# EAGLE schematic Meadowlark_Mini_Schematic_v30 (EAGLE 9.7.0)
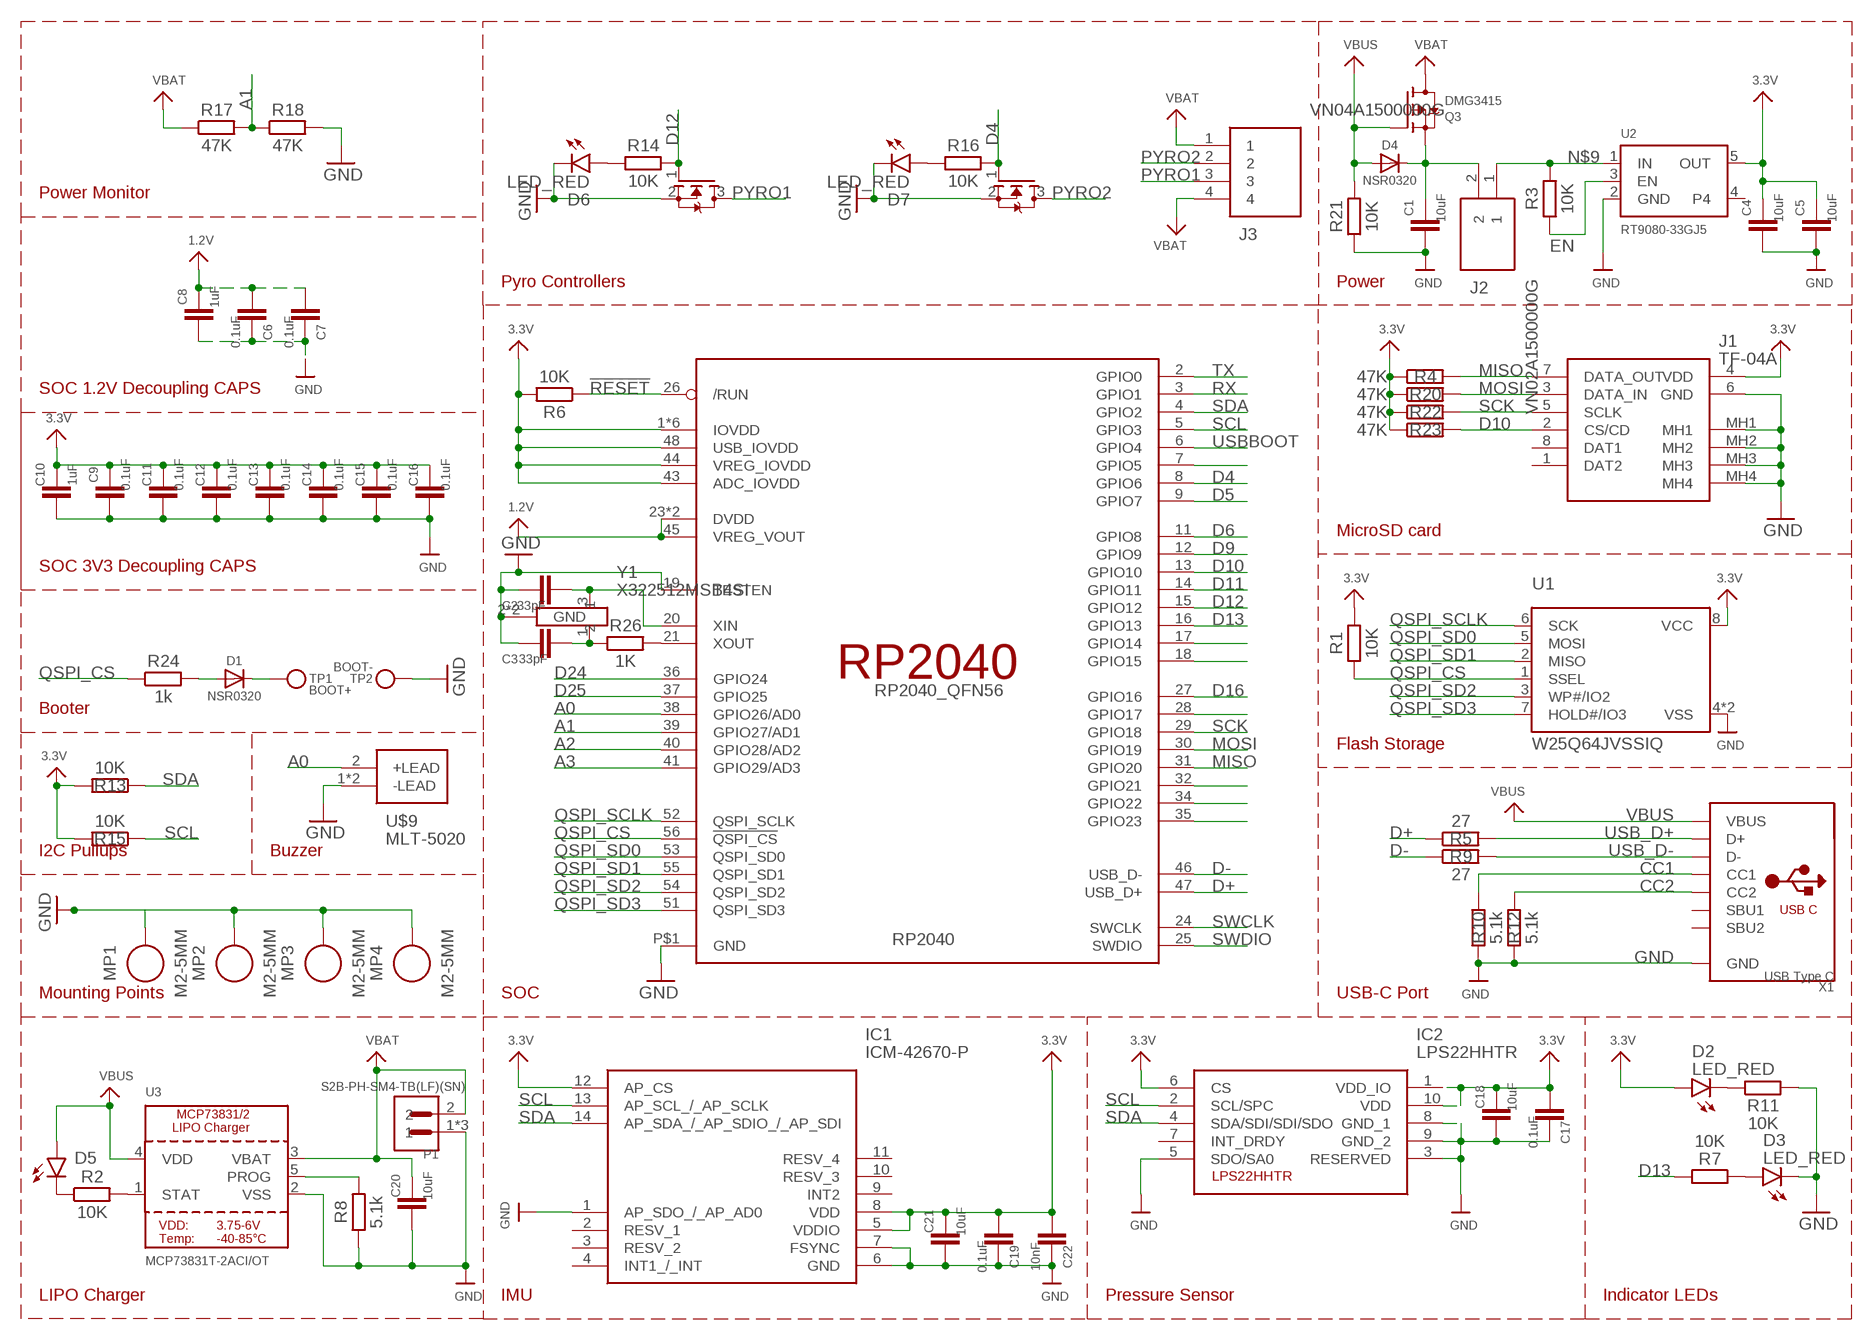
[diagram p0: schematic, sheet 1]

## Parts
C1  10uF  C_CHIP-0402(1005-METRIC)  [CAPC1005X60]
C2  33pF  C_CHIP-0402(1005-METRIC)  [CAPC1005X60]
C3  33pF  C_CHIP-0402(1005-METRIC)  [CAPC1005X60]
C4  10uF  C_CHIP-0402(1005-METRIC)  [CAPC1005X60]
C5  10uF  C_CHIP-0402(1005-METRIC)  [CAPC1005X60]
C6  0.1uF  C_CHIP-0402(1005-METRIC)  [CAPC1005X60]
C7  0.1uF  C_CHIP-0402(1005-METRIC)  [CAPC1005X60]
C8  1uF  C_CHIP-0402(1005-METRIC)  [CAPC1005X60]
C9  0.1uF  C_CHIP-0402(1005-METRIC)  [CAPC1005X60]
C10  1uF  C_CHIP-0402(1005-METRIC)  [CAPC1005X60]
C11  0.1uF  C_CHIP-0402(1005-METRIC)  [CAPC1005X60]
C12  0.1uF  C_CHIP-0402(1005-METRIC)  [CAPC1005X60]
C13  0.1uF  C_CHIP-0402(1005-METRIC)  [CAPC1005X60]
C14  0.1uF  C_CHIP-0402(1005-METRIC)  [CAPC1005X60]
C15  0.1uF  C_CHIP-0402(1005-METRIC)  [CAPC1005X60]
C16  0.1uF  C_CHIP-0402(1005-METRIC)  [CAPC1005X60]
C17  0.1uF  C_CHIP-0402(1005-METRIC)  [CAPC1005X60]
C18  10uF  C_CHIP-0402(1005-METRIC)  [CAPC1005X60]
C19  0.1uF  C_CHIP-0402(1005-METRIC)  [CAPC1005X60]
C20  10uF  C_CHIP-0402(1005-METRIC)  [CAPC1005X60]
C21  10uF  C_CHIP-0402(1005-METRIC)  [CAPC1005X60]
C22  10nF  C_CHIP-0402(1005-METRIC)  [CAPC1005X60]
D1  NSR0320  DIODE_SOD323MINI  [SOD-323_MINI]
D2  LED_RED  CHIP-FLAT-R_0603-0.55MM  [LEDC1608X55N_FLAT-R]
D3  LED_RED  CHIP-FLAT-R_0603-0.55MM  [LEDC1608X55N_FLAT-R]
D4  NSR0320  DIODE_SOD323MINI  [SOD-323_MINI]
D5  LED_YELLOW  CHIP-FLAT-Y_0603-0.55MM  [LEDC1608X55N_FLAT-Y]
D6  LED_RED  CHIP-FLAT-R_0603-0.55MM  [LEDC1608X55N_FLAT-R]
D7  LED_RED  CHIP-FLAT-R_0603-0.55MM  [LEDC1608X55N_FLAT-R]
IC1  ICM-42670-P  [ICM42670P]
IC2  LPS22HHTR  [LPS22HHTR]
J1  TF-04A  [TF04A]
J2  VN02A1500000G  [VN02A1500000G]
J3  VN04A1500000G  [VN04A1500000G]
MP1  M2-5MM  STANDOFF_M/F_M2_5MM  [STANDOFF_HEX_MALE-FEMALE_400X500_M2X0.4_MTGP600H220]
MP2  M2-5MM  STANDOFF_M/F_M2_5MM  [STANDOFF_HEX_MALE-FEMALE_400X500_M2X0.4_MTGP600H220]
MP3  M2-5MM  STANDOFF_M/F_M2_5MM  [STANDOFF_HEX_MALE-FEMALE_400X500_M2X0.4_MTGP600H220]
MP4  M2-5MM  STANDOFF_M/F_M2_5MM  [STANDOFF_HEX_MALE-FEMALE_400X500_M2X0.4_MTGP600H220]
P1  S2B-PH-SM4-TB(LF)(SN)  [JST_S2B-PH-SM4-TB(LF)(SN)]
Q1  AO3400A  MOSFET-NWIDE  [SOT23-WIDE]
Q2  AO3400A  MOSFET-NWIDE  [SOT23-WIDE]
Q3  DMG3415  MOSFET-P  [SOT23-R]
R1  10K  RESISTOR__CHIP-0402(1005-METRIC)  [RESC1005X40]
R2  10K  RESISTOR__CHIP-0402(1005-METRIC)  [RESC1005X40]
R3  10K  RESISTOR__CHIP-0402(1005-METRIC)  [RESC1005X40]
R4  47K  RESISTOR__CHIP-0402(1005-METRIC)  [RESC1005X40]
R5  27  RESISTOR__CHIP-0402(1005-METRIC)  [RESC1005X40]
R6  10K  RESISTOR__CHIP-0402(1005-METRIC)  [RESC1005X40]
R7  10K  RESISTOR__CHIP-0402(1005-METRIC)  [RESC1005X40]
R8  5.1k  RESISTOR__CHIP-0402(1005-METRIC)  [RESC1005X40]
R9  27  RESISTOR__CHIP-0402(1005-METRIC)  [RESC1005X40]
R10  5.1k  RESISTOR__CHIP-0402(1005-METRIC)  [RESC1005X40]
R11  10K  RESISTOR__CHIP-0402(1005-METRIC)  [RESC1005X40]
R12  5.1k  RESISTOR__CHIP-0402(1005-METRIC)  [RESC1005X40]
R13  10K  RESISTOR__CHIP-0402(1005-METRIC)  [RESC1005X40]
R14  10K  RESISTOR__CHIP-0402(1005-METRIC)  [RESC1005X40]
R15  10K  RESISTOR__CHIP-0402(1005-METRIC)  [RESC1005X40]
R16  10K  RESISTOR__CHIP-0402(1005-METRIC)  [RESC1005X40]
R17  47K  RESISTOR__CHIP-0402(1005-METRIC)  [RESC1005X40]
R18  47K  RESISTOR__CHIP-0402(1005-METRIC)  [RESC1005X40]
R20  47K  RESISTOR__CHIP-0402(1005-METRIC)  [RESC1005X40]
R21  10K  RESISTOR__CHIP-0402(1005-METRIC)  [RESC1005X40]
R22  47K  RESISTOR__CHIP-0402(1005-METRIC)  [RESC1005X40]
R23  47K  RESISTOR__CHIP-0402(1005-METRIC)  [RESC1005X40]
R24  1k  R_CHIP-0402(1005-METRIC)  [RESC1005X40]
R26  1K  RESISTOR__CHIP-0402(1005-METRIC)  [RESC1005X40]
RP2040  RP2040_QFN56  [QFN56_7MM_REDUCEDEPAD]
TP1  BOOT+  TESTPOINTROUND1.5MMNO  [TESTPOINT_ROUND_1.5MM_NO]
TP2  BOOT-  TESTPOINTROUND1.5MMNO  [TESTPOINT_ROUND_1.5MM_NO]
U1  W25Q64JVSSIQ  SPIFLASH_8PIN_4X4  [USON8_4X4]
U2  RT9080-33GJ5  VREG_SOT23-5  [SOT23-5]
U3  MCP73831T-2ACI/OT  MCP73831/2  [SOT23-5]
U$9  MLT-5020  [MLT5020]
X1  USB Type C  USB_C  [USB_C_CUSB31-CFM2AX-01-X]
Y1  X322512MSB4SI  [X322512MSB4SI]

## Nets
1.2V: C6.2 C7.2 C8.1 RP2040.23(DVDD) RP2040.45(VREG_VOUT) RP2040.50(DVDD)
3.3V: C4.1 C5.1 C9.1 C10.1 C11.1 C12.1 C13.1 C14.1 C15.1 C16.1 C17.2 C18.1 C19.2 C21.1 C22.2 D2.A IC1.5(VDDIO) IC1.8(VDD) IC1.12(AP_CS) IC2.1(VDD_IO) IC2.6(CS) IC2.10(VDD) J1.4(VDD) R1.2 R4.1 R6.2 R13.2 R15.2 R20.1 R22.1 R23.1 RP2040.1(IOVDD) RP2040.10(IOVDD) RP2040.22(IOVDD) RP2040.33(IOVDD) RP2040.42(IOVDD) RP2040.43(ADC_IOVDD) RP2040.44(VREG_IOVDD) RP2040.48(USB_IOVDD) RP2040.49(IOVDD) U1.8(VCC) U2.5(OUT)
!RESET: R6.1 RP2040.26(/RUN)
A0: RP2040.38(GPIO26/AD0) U$9.2(+LEAD)
A1: R17.2 R18.1 RP2040.39(GPIO27/AD1)
A2: RP2040.40(GPIO28/AD2)
A3: RP2040.41(GPIO29/AD3)
CC1: R10.2 X1.A5(CC1)
CC2: R12.2 X1.B5(CC2)
D4: Q2.1(G) R16.2 RP2040.8(GPIO6)
D5: RP2040.9(GPIO7)
D6: RP2040.11(GPIO8)
D9: RP2040.12(GPIO9)
D10: J1.2(CS/CD) R23.2 RP2040.13(GPIO10)
D11: RP2040.14(GPIO11)
D12: Q1.1(G) R14.2 RP2040.15(GPIO12)
D13: R7.2 RP2040.16(GPIO13)
D16: RP2040.27(GPIO16)
D24: RP2040.36(GPIO24)
D25: RP2040.37(GPIO25)
D+: R5.1 RP2040.47(USB_D+)
D-: R9.1 RP2040.46(USB_D-)
EN: R3.1 U2.3(EN)
GND [power]: C1.2 C2.1 C3.1 C4.2 C5.2 C6.1 C7.1 C8.2 C9.2 C10.2 C11.2 C12.2 C13.2 C14.2 C15.2 C16.2 C17.1 C18.2 C19.1 C20.2 C21.2 C22.1 D3.C D6.C D7.C IC1.1(AP_SDO_/_AP_AD0) IC1.6(GND) IC1.7(FSYNC) IC2.3(RESERVED) IC2.5(SDO/SA0) IC2.8(GND_1) IC2.9(GND_2) J1.6(GND) J1.MH1 J1.MH2 J1.MH3 J1.MH4 MP1.1 MP2.1 MP3.1 MP4.1 P1.1 P1.P1 P1.P2 Q1.2(S) Q2.2(S) R8.1 R10.1 R11.2 R12.1 R18.2 R21.1 RP2040.19(TESTEN) RP2040.P$1(GND) TP2.P$1 U1.4(VSS) U1.PAD(VSS) U2.2(GND) U3.2(VSS) U$9.1(-LEAD) U$9.3(-LEAD) X1.A1B12(GND) X1.B1A12(GND) Y1.2(GND) Y1.4(GND)
MISO: J1.7(DATA_OUT) R4.2 RP2040.31(GPIO20)
MOSI: J1.3(DATA_IN) R20.2 RP2040.30(GPIO19)
N$1: D5.C R2.1
N$2: D2.C R11.1
N$3: R2.2 U3.1(STAT)
N$4: R8.2 U3.5(PROG)
N$5: D6.A R14.1
N$6: C3.2 R26.1 Y1.1
N$7: R26.2 RP2040.21(XOUT)
N$8: D1.A R24.2
N$9 [power]: J2.1 R3.2 U2.1(IN)
N$10: D3.A R7.1
N$11: D7.A R16.1
N$12: RP2040.17(GPIO14)
N$13: C2.2 RP2040.20(XIN) Y1.3
N$14: RP2040.18(GPIO15)
N$15: RP2040.7(GPIO5)
N$18: RP2040.28(GPIO17)
N$19: RP2040.32(GPIO21)
N$20: RP2040.34(GPIO22)
N$21: RP2040.35(GPIO23)
PYRO1: J3.3 Q1.3(D)
PYRO2: J3.2 Q2.3(D)
QSPI_CS: R1.1 R24.1 RP2040.56(!QSPI_CS) U1.1(SSEL)
QSPI_SCLK: RP2040.52(QSPI_SCLK) U1.6(SCK)
QSPI_SD0: RP2040.53(QSPI_SD0) U1.5(MOSI)
QSPI_SD1: RP2040.55(QSPI_SD1) U1.2(MISO)
QSPI_SD2: RP2040.54(QSPI_SD2) U1.3(WP#/IO2)
QSPI_SD3: RP2040.51(QSPI_SD3) U1.7(HOLD#/IO3)
RX: RP2040.3(GPIO1)
SCK: J1.5(SCLK) R22.2 RP2040.29(GPIO18)
SCL: IC1.13(AP_SCL_/_AP_SCLK) IC2.2(SCL/SPC) R15.1 RP2040.5(GPIO3)
SDA: IC1.14(AP_SDA_/_AP_SDIO_/_AP_SDI) IC2.4(SDA/SDI/SDI/SDO) R13.1 RP2040.4(GPIO2)
SWCLK: RP2040.24(SWCLK)
SWDIO: RP2040.25(SWDIO)
TX: RP2040.2(GPIO0)
USB_D+: R5.2 X1.A6(D+) X1.B6(D+)
USB_D-: R9.2 X1.A7(D-) X1.B7(D-)
USBBOOT: D1.C RP2040.6(GPIO4) TP1.P$1
VBAT [power]: C20.1 J3.1 J3.4 P1.2 Q3.3(D) R17.1 U3.3(VBAT)
VBUS [power]: D4.A D5.A Q3.1(G) R21.2 U3.4(VDD) X1.A4B9(VBUS) X1.B4A9(VBUS)
VHI [power]: C1.1 D4.C J2.2 Q3.2(S)
Unconnected: IC1.2(RESV_1) IC1.3(RESV_2) IC1.4(INT1_/_INT) IC1.9(INT2) IC1.10(RESV_3) IC1.11(RESV_4) IC2.7(INT_DRDY) J1.1(DAT2) J1.8(DAT1) U2.4 X1.A8(SBU1) X1.B8(SBU2)

## Notes on the sheet
- Power Monitor
- Pyro Controllers | Power
- SOC 1.2V Decoupling CAPS
- MicroSD card
- SOC 3V3 Decoupling CAPS
- Booter
- Flash Storage
- I2C Pullups | Buzzer
- Mounting Points | SOC | USB-C Port
- LIPO Charger | IMU | Pressure Sensor | Indicator LEDs

## Library data of the parts
C1-C22 = Capacitor:C: Capacitor - Generic; CATEGORY: Capacitor
D1 D4 = microbuilder:DIODE: Diode SMA Model Volts Amps Type Vf Ir Digikey # Notes SSA34-E3 40V 3A Schottky 480mV @ 3A 200uA @ 40V SSA34-E3/61TGITR-ND CDBA120-G 20V 1A Schottky 500mV @ 1A 500uA @ 20V 641-1014-6-ND REEL MBRA210 10V 2A Schottky 350mV @ 2A 700uA @ 10V MBRA210LT3 SOD-123 Model Volts Amps Type Vf Ir Order # Notes BAT54T1G 30V 200mA Schottky 800mV @ 200mA 2uA @ 25V BAT54T1GOSTR-ND B0530W 30V 500mA Schottky 430mV @ 500mA 130uA @ 30V B0530W-FDICT-ND REEL MBR120 20V 1A Schottky 340mV @ 1A MBR120VLSFT1GOSCT-ND SOD-323 Model Volts Amps Type Vf Ir Order # Notes PMEG2005EJ 20V 500mA Schottky 355mV @ 500mA 568-4110-1-ND ZLLS410 10V 570mA Schottky 380mV @ 570mA ZLLS410CT-ND 1N4148WS 75V 150mA Silicon/Simple 1V 1N4148WSFSCT-ND REEL SOD-523 Model Volts Amps Type Vf Ir Order # Notes BAT54XV2 30V 200mA Schottky 0.8V @ 100mA BAT54XV2CT-ND TB751S 30V 30mA Schottky RB751S-40TE61CT-ND SOT23-R/W (R = Solder Paste/Reflow Ovens, W = Hand-Soldering) Model Volts Amps Type Vf Ir Order # Notes BAT54FILM 40V 300mA Schottky 497-7162-1-ND POWERDI-5 Model Volts Amps Type Vf Ir Order # Notes PDS560 60V 5A Schottky 670mV @ 5A 150uA @ 60V PDS560DICT-ND
D2 D3 D6 D7 = LED:CHIP-FLAT-R; CATEGORY: LED; COLOR: RED; DESCRIPTION: CHIP LED FLAT; SUB-CATEGORY: CHIP; TYPE: FLAT_TOP
D5 = LED:CHIP-FLAT-Y; CATEGORY: LED; COLOR: YELLOW; DESCRIPTION: CHIP LED FLAT; SUB-CATEGORY: CHIP; TYPE: FLAT_TOP
IC1 = ICM-42670-P:ICM-42670-P: IMUs - Inertial Measurement Units Low-Power, Premium Performance 6-Axis MotionTrackingTM IMU with I3C, I2C and SPI interface in 2.5mm x 3mm Package Source: Datasheet <https://3cfeqx1hf82y3xcoull08ihx-wpengine.netdna-ssl.com/wp-content/uploads/2021/07/DS-000451-ICM-42670-P-v1.0.pdf>; DESCRIPTION: IMUs - Inertial Measurement Units Low-Power, Premium Performance 6-Axis MotionTrackingTM IMU with I3C, I2C and SPI interface in 2.5mm x 3mm Package; HEIGHT: mm; MANUFACTURER_NAME: TDK; MANUFACTURER_PART_NUMBER: ICM-42670-P; MOUSER_PART_NUMBER: 410-ICM-42670-P; MOUSER_PRICE-STOCK: https://www.mouser.co.uk/ProductDetail/TDK-InvenSense/ICM-42670-P?qs=iLbezkQI%252BsgK8sMF5V7fQQ%3D%3D
IC2 = LPS22HHTR:LPS22HHTR: STMICROELECTRONICS - LPS22HHTR - PRESSURE SENSOR, HLGA-10 Source: Datasheet <https://www.st.com/resource/en/datasheet/lps22hh.pdf>; ARROW_PART_NUMBER: LPS22HHTR; ARROW_PRICE-STOCK: https://www.arrow.com/en/products/lps22hhtr/stmicroelectronics?region=nac; DESCRIPTION: STMICROELECTRONICS - LPS22HHTR - PRESSURE SENSOR, HLGA-10; HEIGHT: mm; MANUFACTURER_NAME: STMicroelectronics; MANUFACTURER_PART_NUMBER: LPS22HHTR; MOUSER_PART_NUMBER: 511-LPS22HHTR; MOUSER_PRICE-STOCK: https://www.mouser.co.uk/ProductDetail/STMicroelectronics/LPS22HHTR?qs=lc2O%252BfHJPVbKAkJQGWFcLg%3D%3D
J1 = TF-04A:TF-04A: 13.55*13.51mm Card Sockets Connectors Source: Datasheet <https://datasheet.lcsc.com/szlcsc/1903221102_Korean-Hroparts-Elec-TF-04A_C145799.pdf>; DESCRIPTION: 13.55*13.51mm Card Sockets Connectors; HEIGHT: 1.5mm; MANUFACTURER_NAME: Korean Hroparts Elec; MANUFACTURER_PART_NUMBER: TF-04A
J2 = VN02A1500000G:VN02A1500000G: 2 Position Wire to Board Terminal Block Horizontal with Board 0.100" (2.54mm) Through Hole Source: Datasheet <http://www.anytek.com.tw/UserUpFiles/20120512/L_wOt9EJEyJN.pdf>; DESCRIPTION: 2 Position Wire to Board Terminal Block Horizontal with Board 0.100" (2.54mm) Through Hole; HEIGHT: 8.8mm; MANUFACTURER_NAME: Amphenol; MANUFACTURER_PART_NUMBER: VN02A1500000G; MOUSER_PART_NUMBER: 649-VN02A15000J0G; MOUSER_PRICE-STOCK: https://www.mouser.co.uk/ProductDetail/Amphenol-Anytek/VN02A1500000G?qs=Mv7BduZupUgf8d3Xo6xdxw%3D%3D
J3 = VN04A1500000G:VN04A1500000G: 4 Position Wire to Board Terminal Block Horizontal with Board 0.100" (2.54mm) Through Hole Source: Datasheet <http://www.anytek.com.tw/UserUpFiles/20120512/L_wOt9EJEyJN.pdf>; DESCRIPTION: 4 Position Wire to Board Terminal Block Horizontal with Board 0.100" (2.54mm) Through Hole; HEIGHT: 8.8mm; MANUFACTURER_NAME: Amphenol; MANUFACTURER_PART_NUMBER: VN04A1500000G; MOUSER_PART_NUMBER: 649-VN04A15000J0G; MOUSER_PRICE-STOCK: https://www.mouser.co.uk/ProductDetail/Amphenol-Anytek/VN04A1500000G?qs=Mv7BduZupUg1gSttWAc7xA%3D%3D
MP1-MP4 = PCB-Fasteners_Hardware:STANDOFF_M/F: Male-Male Standoff/Spacer with Mounting pad and hole. Essentra : Male-Female Standoff <https://www.essentracomponents.co.in/index.php?option=com_virtuemart&view=productdetails&virtuemart_product_id=14556> The hole and pad sizes may vary based on the application and type of hardware; always verify the Manufacturer specification or Global Standards.; CATEGORY: Standoff/Spacer; SUB-CATEGORY: Male-Female
P1 = S2B-PH-SM4-TB_LF__SN_:S2B-PH-SM4-TB(LF)(SN): CONN HEADER PH SIDE 2POS 2MM SMD Check availability <https://pricing.snapeda.com/parts/S2B-PH-SM4-TB%20%28LF%29%28SN%29/JST%20Sales/view-part?ref=eda>; AVAILABILITY: In Stock; CHECK_PRICES: https://www.snapeda.com/parts/S2B-PH-SM4-TB%20(LF)(SN)/JST+Sales+America+Inc./view-part/?ref=eda; DESCRIPTION: Connector Header Surface Mount, Right Angle 2 position 0.079 (2.00mm); MF: JST Sales; MP: S2B-PH-SM4-TB (LF)(SN); PACKAGE: None; PRICE: None; SNAPEDA_LINK: https://www.snapeda.com/parts/S2B-PH-SM4-TB%20(LF)(SN)/JST+Sales+America+Inc./view-part/?ref=snap
Q1 Q2 = microbuilder:MOSFET-N: N-Channel Mosfet LEGEND VDS: Voltage Drain-Source ID: Drain Current RDS(ON): Drain-Source On-State Resistance VGS(TH): Gate-Source Threshold Voltage CISS: Drain-Source Input Capacitance SOT-23 Name VDS ID RDS(ON) VGS(TH) CISS Order Number 2N7002E 60V 260mA 2.5 Ohm 2.5V @ 250uA 26.7pF @ 25V 2N7002ET1GOSTR-ND BSH103 30V 850mA 400 mOhm 400mV @ 1mA 83pF @ 24V BSH103,235-ND BSS138 60V 320mA 1.6 Ohm 1.5V @ 250uA 50pF @ 10V Mouser: 771-BSS138PW115 DMN2075U-7 20V 4.2A 38 mOhm 1V @ 250 uA 594.3pF @ 10V DMN2075U-7DICT-ND * BSS138 good choice for I2C level-shifting POWERPAK 1212-8 Name VDS ID RDS(ON) VGS(TH) CISS Order Number Si7308DN 60V 6A 58 mOhm 3V @ 250uA 665pF @ 15V SI7308DN-T1-E3CT-ND
Q3 = microbuilder:MOSFET-P: P-Channel Mosfet LEGEND VDS: Voltage Drain-Source ID: Drain Current RDS(ON): Drain-Source On-State Resistance VGS(TH): Gate-Source Threshold Voltage CISS: Drain-Source Input Capacitance SOT-23 Name VDS ID RDS(ON) VGS(TH) CISS Order Number IRLML5103 30V 760mA 600 mOhm -- 75pF @ 25V Digikey: IRLML5103PBFCT-ND IRLML6401 12V 4.3A 50 mOhm 950mV @ 250µA 830pF @ 10V Digikey: IRLML6401PBFTR-ND NTR0202PL 20V 400mA 800 mOhm 2.3V @ 250uA 70pF @ 5V Digikey: NTR0202PLT1GOSTR-ND NTR4101PT1G 20V 1.8A 85 mOhm 1.2V @ 250uA 675pF @ 10V Digikey: NTR4101PT1GOSCT-ND DMP2004K 20V 600mA 900 mOhm 1V @ 250uA 175pF @ 16V Digikey: DMP2004KDICT-ND PMV65XP 20V 3.9A 76 mOhm 950mV @ 1mA 725pF @ 20V Digikey: 568-2358-2-ND TO-252 Name VDS ID RDS(ON) VGS(TH) CISS Order Number AOD417 30V 25A 34 mOhm 3V @ 250µA 920pF @ 15V Digikey: 785-1106-2-ND PowerPak Name VDS ID RDS(ON) VGS(TH) CISS Order Number AON7401 30V 12A 14 mOhm 3V @ 250µA 2600pF @ 15V Digikey: 785-1302-1-ND
R1-R18 R20-R23 R26 = Tinkercad:RESISTOR: Resistor Fixed - Generic; CATEGORY: Resistor; SUB-CATEGORY: Fixed
R24 = Resistor:R: Resistor Fixed - Generic; CATEGORY: Resistor; SUB-CATEGORY: Fixed
RP2040 = adafruit_micro:RP2040; LCSC: C2040
TP1 TP2 = microbuilder:TESTPOINT: Test Point Various test points for characterisation and PCB testing TESTPOINT_SMT - Compact Surface Mount Test Point [Digikey: 5016KTR-ND]
U1 = microbuilder:SPIFLASH_8PIN: SOIC8 SPI Flash Be careful with the size since SOIC8 flash comes in several 'widths' SOIC8 150 mil M25P16 - 16Mbit (2Mbit x 8) Serial Flash (75MHz SPI Bus), Supply: 2.7-3.6V Digikey: SOIC8 - M25P16-VMN6P-ND SOIC8 208 mil W25Q16BVSSIG - 16Mbit (2Mbit x 8) Serial Flash (104MHz SPI Bus), Supply: 2.7-3.6V Digikey: SOIC8 - W25Q16BVSSIG-ND
U2 = adafruit_power:VREG_SOT23-5: SOT23-5 Fixed Voltage Regulators Part Current Out V Out V In V Dropout θJA (°C/W) TJ (°C) Digikey Part No. ADP121 150mA 3.3V 3.4-5.5V 0.09V @ 150mA -- -- ADP121-AUJZ33R7CT-ND ADP121 150mA 3.0V 3.1-5.5V 0.09V @ 150mA -- -- ADP121-AUJZ30R7CT-ND ADP122 300mA 3.3V 3.4-5.5V 0.085V @ 300mA -- -- ADP122AUJZ-3.3-R7CT-ND ADP1712 300mA 3.3V 3.5-5.5V 0.17V @ 300mA -- -- ADP1712AUJZ-3.3-R7TR-ND AP7311 (Low Cost) 150mA 3.3V 3.5-6V 0.15V @ 150mA -- -- AP7311-33WG-7DICT-ND LD39015M18R 150mA 1.8V 1.9V-5.5V 0.08V @ 100mA -- -- 497-6977-1-ND LP2985A-33DBVR 150mA 3.3V 3.3-16V 0.28V @ 150mA 206 150 296-18479-1-ND MCP1824T-3302E/OT 300mA 3.3V 3.5V-6V 0.2V @ 300mA -- -- MCP1824T-3302E/OTCT-ND MIC5205-2.5YM5 TR 150mA 2.5V 2.7-16V 0.165V @ 150mA -- -- 576-1257-2-ND MIC5205-3.0YM5 TR 150mA 3.0V 3.2V-16V 0.165V @ 150mA -- -- 576-1258-2-ND MIC5205-3.3YM5 TR 150mA 3.3V 3.5V-16V 0.165V @ 150mA -- -- 576-1259-2-ND TPS780330220 150mA 3.3V+2.2V 3.6-5.5V 250mV Max -- -- 296-23332-1-ND TDA3663/N1,135 100mA 3.3V 3.5-45V 0.18V @ 50mA -- -- 568-5343-1-ND Max operating temp can be calculated using θJA, TJ (max junction temperature), and power in watts. Set the "Maximum Ambient Temperature" until it reaches TJ ("Max Junction Temperature"), which is the absolute limit for safe use of the regulator: Heat Sink Temperature Calculator <http://www.daycounter.com/Calculators/Heat-Sink-Temperature-Calculator.phtml> For example, With 12V source into a 3.3V LP2985 and a 30mA load, we are dissipating (12V-3.3V) * 0.03A = 0.261W. With a θJA of 206 °C/W, a TJ of 150°C, and 261mW we can safely use the chip without a heat sink up to 75°C (=147.1°C Junction Temperature).; JLC_ROTATION: 0
U3 = microbuilder:MCP73831/2: MCP73831/2 LIPO Charger VDD: 3.75 - 6V Temp -40 - 85°C Programmable Charge Rate: 15-500mA NOTE: STAT is a tri-state logic output on the MCP73831 and an open-drain output on the MCP73832. SOT23-5 with 4.2V output and tri-state logic on STAT = MCP73831T-2ACI/OT; JLC_ROTATION: 270; LCSC: C424093
U$9 = MLT-XXXX:MLT-5020
X1 = adafruit_electromech:USB_C: USB Type-C USB 2.0 Connector; LCSC: C165948
Y1 = X322512MSB4SI:X322512MSB4SI: SMD Crystal Resonators 12MHz +/-10ppm SMD-3225_4P RoHS Source: Datasheet <https://datasheet.lcsc.com/szlcsc/Yangxing-Tech-X322512MSB4SI_C9002.pdf>; DESCRIPTION: SMD Crystal Resonators 12MHz +/-10ppm SMD-3225_4P RoHS; HEIGHT: 0.8mm; MANUFACTURER_NAME: Yangxing Tech; MANUFACTURER_PART_NUMBER: X322512MSB4SI

## Net classes
1 power: width 0.305 mm